# Altium schematic sheet MCU_RS485.SchDoc
size A4; SheetNumber: 3; SheetTotal: 3
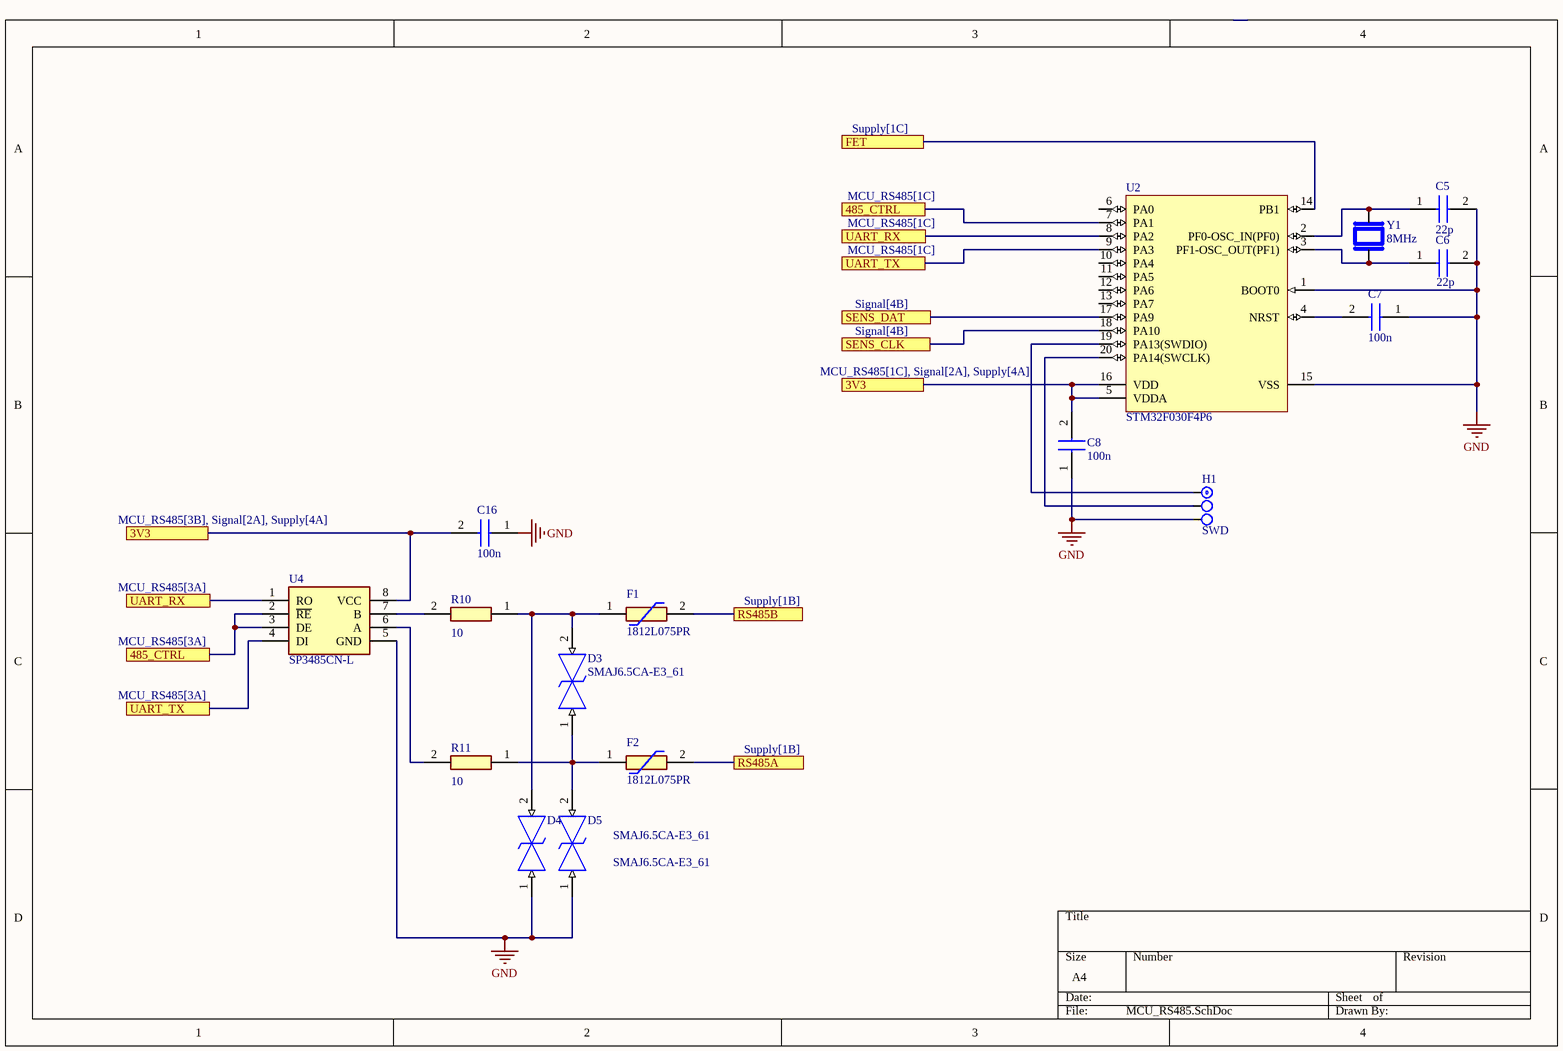
[diagram p0: MCU_RS485.SchDoc]

## Parts
C5  22p  [CAPC2012X94N]
C6  22p  [CAPC2012X94N]
C7  100n  [CAPC2012X94N]
C8  100n  [CAPC2012X94N]
C16  100n  [CAPC2012X94N]
D3  SMAJ6.5CA-E3_61  [DIONM5127X229N]
D4  SMAJ6.5CA-E3_61  [DIONM5127X229N]
D5  SMAJ6.5CA-E3_61  [DIONM5127X229N]
F1  1812L075PR  [1812L010DR]
F2  1812L075PR  [1812L010DR]
H1  SWD  [J1x3]
R10  10  [RESC2012X65N]
R11  10  [RESC2012X65N]
U2  STM32F030F4P6  [STM-TSSOP20_L]
U4  SP3485CN-L  [SOIC127P600X175-8N]
Y1  8MHz  [XTAL_ABM3-14.7456MHZ-D2Y-T]

## Ports
3V3 (see MCU_RS485[1C], Signal[2A], Supply[4A]), 3V3 (see MCU_RS485[3B], Signal[2A], Supply[4A]), 485_CTRL (see MCU_RS485[1C]), 485_CTRL (see MCU_RS485[3A]), FET (see Supply[1C]), RS485A (see Supply[1B]), RS485B (see Supply[1B]), SENS_CLK (see Signal[4B]), SENS_DAT (see Signal[4B]), UART_RX (see MCU_RS485[1C]), UART_RX (see MCU_RS485[3A]), UART_TX (see MCU_RS485[1C]), UART_TX (see MCU_RS485[3A])

## Nets
GND: C5.2 C6.2 C7.1 C8.1 C16.1 D4.1 D5.1 H1.3 U2.1(BOOT0) U2.15(VSS) U4.5(GND)
3V3: C8.2 C16.2 U2.5(VDDA) U2.16(VDD) U4.8(VCC) ; port 3V3
485_CTRL: U2.7(PA1) U4.2(~{RE}) U4.3(DE) ; port 485_CTRL
FET: U2.14(PB1) ; port FET
RS485A: F2.2 ; port RS485A
RS485B: F1.2 ; port RS485B
SENS_CLK: U2.18(PA10) ; port SENS_CLK
SENS_DAT: U2.17(PA9) ; port SENS_DAT
UART_RX: U2.8(PA2) U4.1(RO) ; port UART_RX
UART_TX: U2.9(PA3) U4.4(DI) ; port UART_TX
NetC5_1: C5.1 U2.2(PF0-OSC_IN(PF0)) Y1.2
NetC6_1: C6.1 U2.3(PF1-OSC_OUT(PF1)) Y1.1
NetC7_2: C7.2 U2.4(NRST)
NetD3_1: D3.1 D5.2 F2.1 R11.1
NetD3_2: D3.2 D4.2 F1.1 R10.1
NetH1_1: H1.1 U2.19(PA13(SWDIO))
NetH1_2: H1.2 U2.20(PA14(SWCLK))
NetR10_2: R10.2 U4.7(B)
NetR11_2: R11.2 U4.6(A)

Not connected (* = marked no-connect by the designer): U2 6(PA0) 10(PA4) 11(PA5) 12(PA6) 13(PA7)

## Library data of the parts
C5-C8 C16 = 08055A471FAT4A: Capacitor; Manufacturer_Name: AVX; Datasheet Link: https://componentsearchengine.com/Datasheets/1/06031A100FAT2A.pdf; Height: 0.94mm; Manufacturer_Part_Number: 08055A471FAT4A; Mouser Part Number: 581-08055A471FAT4A; Mouser Price/Stock: https://www.mouser.com/Search/Refine.aspx?Keyword=581-08055A471FAT4A; Arrow Part Number: 08055A471FAT4A; Arrow Price/Stock: https://www.arrow.com/en/products/08055a471fat4a/avx
D3-D5 = SMAJ6.5CA-E3_61: TVS Diode (Bi-directional); Manufacturer_Name: Vishay; Manufacturer_Part_Number: SMAJ6.5CA-E3/61; Datasheet Link: https://componentsearchengine.com/Datasheets/2/SMAJ6.5CA-E3_61.pdf; Height: 2.29mm; Mouser Part Number: 625-SMAJ6.5CA-E3; Mouser Price/Stock: https://www.mouser.co.uk/ProductDetail/Vishay-General-Semiconductor/SMAJ65CA-E3-61?qs=M2MvrwIlMUyD6pU3Wy9iEA%3D%3D; Arrow Part Number: SMAJ6.5CA-E3/61; Arrow Price/Stock: https://www.arrow.com/en/products/smaj6.5ca-e361/vishay?region=nac
F1 F2 = 1812L075PR: Resettable Fuse; Manufacturer_Name: LITTELFUSE; Datasheet Link: http://www.littelfuse.com/~/media/electronics/datasheets/resettable_ptcs/littelfuse_ptc_1812l_datasheet.pdf.pdf; Height: 1.25mm; Manufacturer_Part_Number: 1812L075PR; Mouser Part Number: 576-1812L075PR; Mouser Price/Stock: https://www.mouser.co.uk/ProductDetail/Littelfuse/1812L075PR?qs=PWhpLWeW8weuCGexZfyXng%3D%3D; Arrow Part Number: 1812L075PR; Arrow Price/Stock: https://www.arrow.com/en/products/1812l075pr/littelfuse?region=nac
H1 = H-1x3: Price: 0.03
R10 R11 = CPF0805B102KE1: Resistor; Manufacturer_Name: TE Connectivity; Datasheet Link: http://docs-europe.electrocomponents.com/webdocs/13d1/0900766b813d116f.pdf; Height: 0.65mm; Manufacturer_Part_Number: CPF0805B102KE1; Mouser Part Number: 279-CPF0805B102KE1; Mouser Price/Stock: https://www.mouser.com/Search/Refine.aspx?Keyword=279-CPF0805B102KE1
U2 = STM32F030F4P6: ARM Cortex-M0 32-bit MCU, 16 KB Flash, 4 KB Internal RAM, 15 I/Os, 20-pin TSSOP, -40 to 85 degC, Tube; FLASH Size (Prog) (kB): 16; I/Os (High Current): 15; Internal RAM Size (kB): 4; Operating Frequency(F) (Processor speed) (MHz): 48; Supply Voltage(Vcc) min (V): 2.4; DatasheetVersion: Rev. 1; PackageVersion: Rev. 1, 11/2012; PackageReference: TSSOP20; PackageDescription: 20-Pin Thin Shrink Small Outline Package, 6.5 x 4.4 mm Body, 0.65 mm Pitch; Supplier 1: Digi-Key; Supplier Part Number 1: 497-14044-5-ND; Supplier 2: Newark; Supplier Part Number 2: 06X3648; Supplier 3: Mouser; Supplier Part Number 3: 511-STM32F030F4P6; Core: ARM Cortex-M0; Packing: Tube; Mounting Technology: Surface Mount; PartNumber: STM32F030F4P6; ComponentLink1Description: Manufacturer URL; ComponentLink1URL: http://www.st.com/web/en/home.html; ComponentLink2Description: Datasheet; ComponentLink2URL: http://www.st.com/st-web-ui/static/active/en/resource/technical/document/datasheet/DM00088500.pdf; ComponentLink3Description: Package Specification; ComponentLink3URL: http://www.st.com/st-web-ui/static/active/en/resource/technical/document/datasheet/DM00065136.pdf
U4 = SP3485CN-L: Integrated Circuit; Manufacturer_Name: EXAR; Datasheet Link: https://datasheet.datasheetarchive.com/originals/distributors/Datasheets-DGA14/1190127.pdf; Height: 1.75mm; Manufacturer_Part_Number: SP3485CN-L; Mouser Part Number: 701-SP3485CN-L; Mouser Price/Stock: https://www.mouser.com/Search/Refine.aspx?Keyword=701-SP3485CN-L; Arrow Part Number: SP3485CN-L; Arrow Price/Stock: https://www.arrow.com/en/products/sp3485cn-l/exar
Y1 = ABM3-14.7456MHZ-D2Y-T: Ceramic SMD Crystal; MF: Abracon; Package: SMD-2 Abracon; SnapEDA_Link: https://www.snapeda.com/parts/ABM3-14.7456MHZ-D2Y-T/Abracon+LLC/view-part/?ref=snap; MP: ABM3-14.7456MHZ-D2Y-T; Value: *; Availability: In Stock; Price: None; Purchase-URL: https://pricing.snapeda.com/search/part/ABM3-14.7456MHZ-D2Y-T/?ref=eda; Check_prices: https://www.snapeda.com/parts/ABM3-14.7456MHZ-D2Y-T/Abracon+LLC/view-part/?ref=eda